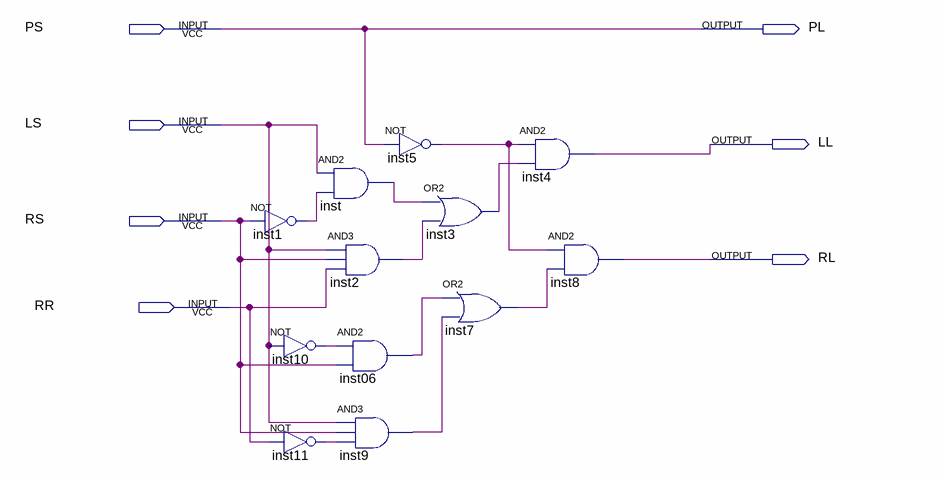
[diagram p0: schematic sheet]
// Quartus schematic lab01.bdf as structural Verilog: 12 symbols, 7 pins
module lab01 (
  input  PS,
  input  LS,
  input  RS,
  input  RR,
  output PL,
  output LL,
  output RL
);

  wire inst1_out, inst2_out, inst3_out, inst5_out, inst06_out, inst7_out, inst9_out, inst10_out, inst11_out,
       inst_out;

  not inst1 (inst1_out, RS);
  and inst (inst_out, LS, inst1_out);
  and inst2 (inst2_out, LS, RS, RR);
  not inst10 (inst10_out, LS);
  not inst11 (inst11_out, RR);
  not inst5 (inst5_out, PS);
  and inst06 (inst06_out, inst10_out, RS);
  and inst9 (inst9_out, LS, RS, inst11_out);
  or inst3 (inst3_out, inst_out, inst2_out);
  or inst7 (inst7_out, inst06_out, inst9_out);
  and inst4 (LL, inst5_out, inst3_out);
  and inst8 (RL, inst5_out, inst7_out);

  assign PL = PS;
endmodule
